# Altium schematic sheet FPGA_Config.SchDoc: FPGA Config
size A4; Author: A. Kalberer; CompanyName: NTB; Organization: NTB Interstate University of Applied; Address1: Werdenbergstrasse 4; Address3: 9471 Buchs; Address4: Switzerland; Organization1: Sciences of Technology Buchs; Size: A4
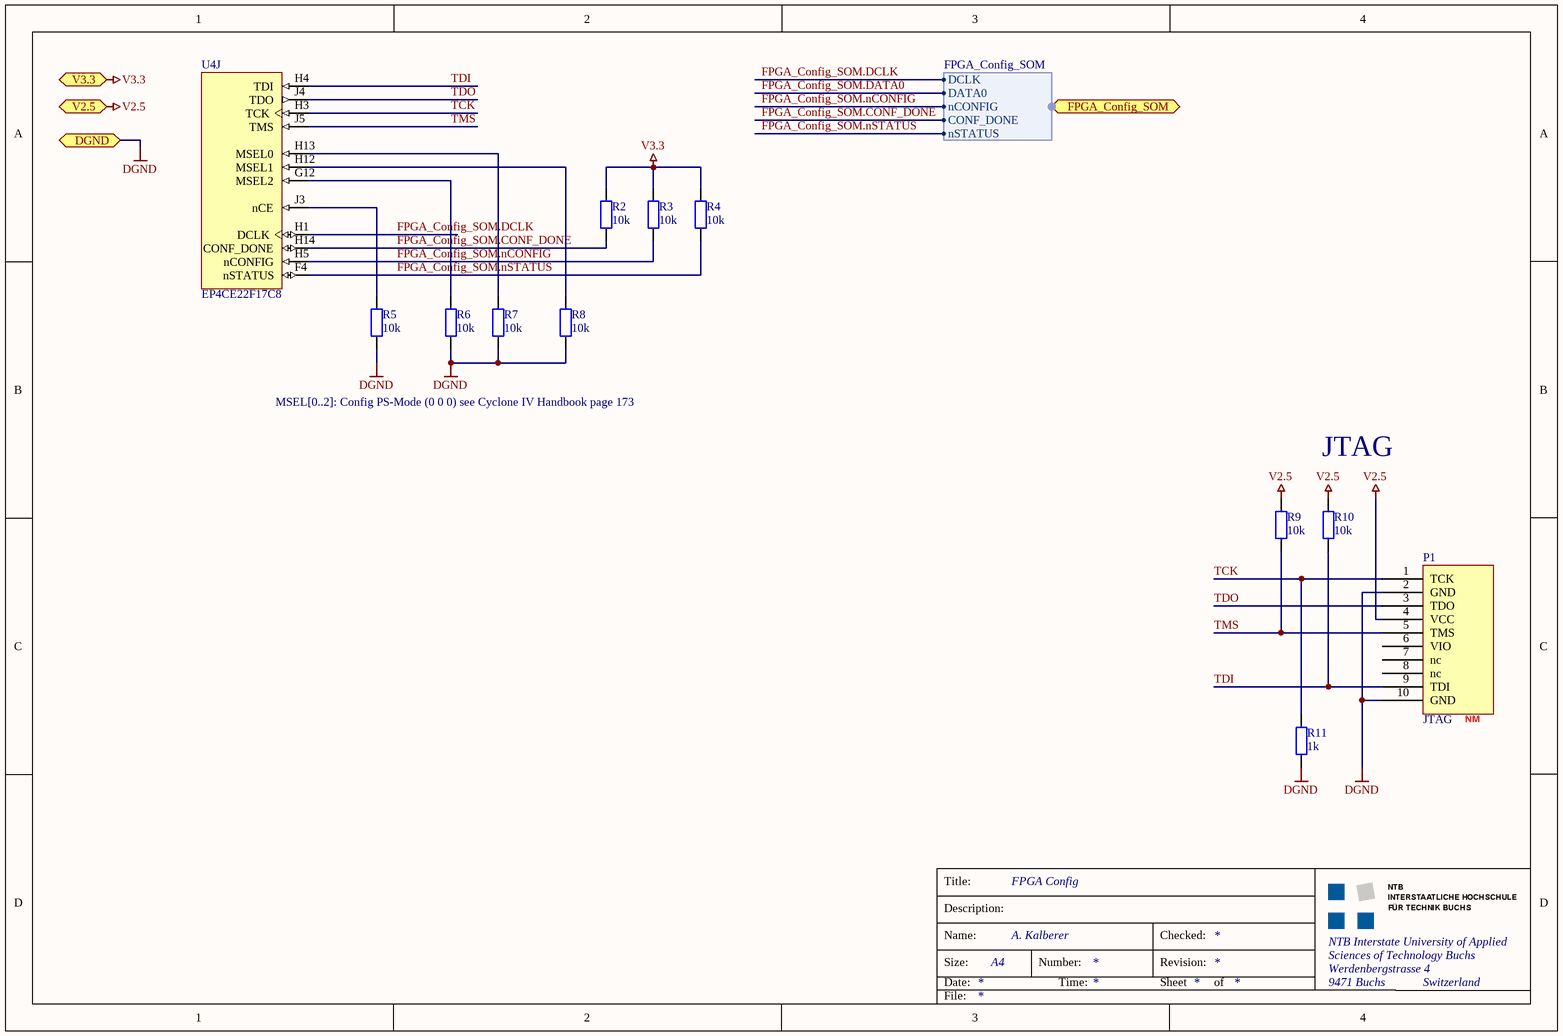
[diagram p0: FPGA_Config.SchDoc]

## Parts
P1  JTAG  [MicroMatch_10PinSMD]
R2  10k  [0603_3D]
R3  10k  [0603_3D]
R4  10k  [0603_3D]
R5  10k  [0603_3D]
R6  10k  [0603_3D]
R7  10k  [0603_3D]
R8  10k  [0603_3D]
R9  10k  [0603_3D]
R10  10k  [0603_3D]
R11  1k  [0603_3D]
U4  EP4CE22F17C8  [FBGA256]  (part J of 13)

## Ports
DGND, FPGA_Config_SOM (harness FPGA_Config_SOM), V2.5, V3.3

## Harnesses
FPGA_Config_SOM: DCLK, DATA0, nCONFIG, CONF_DONE, nSTATUS

## Nets
DGND: P1.2(GND) P1.10(GND) R5.1 R6.1 R7.1 R8.2 R11.1 ; port DGND
V2.5: P1.4(VCC) R9.2 R10.2 ; port V2.5
V3.3: R2.2 R3.2 R4.2 ; port V3.3
FPGA_Config_SOM.CONF_DONE: R2.1 U4.H14(CONF_DONE) ; port FPGA_Config_SOM.CONF_DONE
FPGA_Config_SOM.DATA0: port FPGA_Config_SOM.DATA0
FPGA_Config_SOM.DCLK: U4.H1(DCLK) ; port FPGA_Config_SOM.DCLK
FPGA_Config_SOM.nCONFIG: R3.1 U4.H5(nCONFIG) ; port FPGA_Config_SOM.nCONFIG
FPGA_Config_SOM.nSTATUS: R4.1 U4.F4(nSTATUS) ; port FPGA_Config_SOM.nSTATUS
TCK: P1.1(TCK) R11.2 U4.H3(TCK)
TDI: P1.9(TDI) R10.1 U4.H4(TDI)
TDO: P1.3(TDO) U4.J4(TDO)
TMS: P1.5(TMS) R9.1 U4.J5(TMS)
NetR5_2: R5.2 U4.J3(nCE)
NetR6_2: R6.2 U4.G12(MSEL2)
NetR7_2: R7.2 U4.H13(MSEL0)
NetR8_1: R8.1 U4.H12(MSEL1)

Not connected (* = marked no-connect by the designer): P1 6(VIO) 7(nc) 8(nc)

## Notes on the sheet
- MSEL[0..2]: Config PS-Mode (0 0 0) see Cyclone IV Handbook page 173
- JTAG
- (near P1) NM
- Title:
- Description:
- Size:
- Date:
- Name:
- Number:
- Time:
- Revision:
- Sheet
- Checked:
- of
- File:

## Library data of the parts
P1 = AlteraJTAG: Altera JTAG
R2-R11 = R: Resistor; #Manufacturer: Generic Components; #Publisher: Dr. A. Heinzelmann; #Class: Passive; #Published: 2006-10-06; #ClassSub: Resistor; Type: *
  R2-R10: Value: 10k
  R11: Value: 1k
U4 = EP4CE22F17C8: Cyclone IV Family FPGA, 2V Core, 153 I/O Pins, 4 PLLs, 256-Pin FBGA, Speed Grade 8, Commercial Grade; Published: 3-May-2010; DatasheetVersion: ver1.2, Mar-2010; PackageVersion: ver16.0, Dec-2009; PackageReference: FBGA256; Publisher: Altium Limited; PackageDescription: 256-Ball FineLine Ball Grid Array (FBGA256) - Option 1 - Wire Bond; Supplier 1: Digi-Key; Supplier Part Number 1: EP4CE22F17C8-ND; Code_JEDEC: MS-034-AAF-1; Code_IPC: BGA100P16X16-256; ComponentLink1Description: Manufacturer Link; ComponentLink1URL: http://www.altera.com/; ComponentLink2Description: Handbook; ComponentLink2URL: http://www.altera.com/literature/hb/cyclone-iv/cyclone4-handbook.pdf; ComponentLink3Description: Pinout Specification; ComponentLink3URL: http://www.altera.com/literature/lit-dp.jsp?category=cyc%204&showspreadsheet=y; ComponentLink4Description: Packaging Specification; ComponentLink4URL: http://www.altera.com/literature/ds/dspkg.pdf